# Altium schematic sheet Sedra LPN.SchDoc
size A4
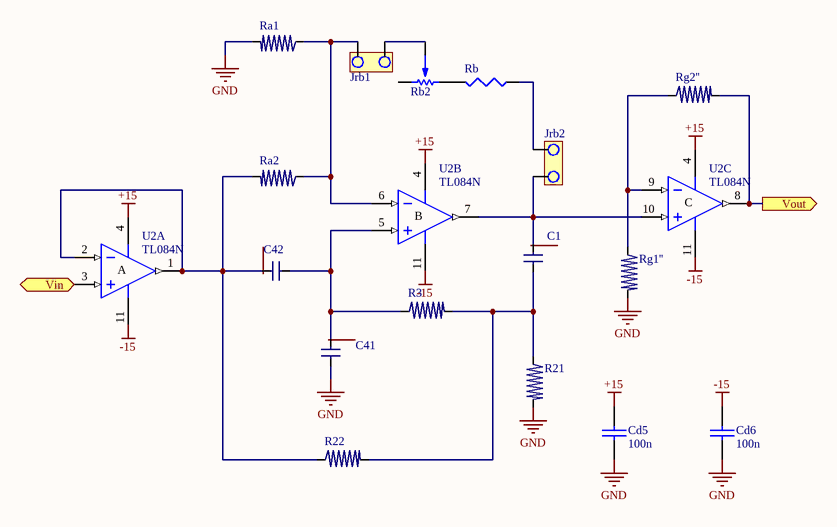
[diagram p0: Sedra LPN.SchDoc]

## Parts
C1  (no value)  [Model Name]
C41  (no value)  [PCBComponent_1]
C42  (no value)  [PCBComponent_1]
Cd5  100n  [CAP200]
Cd6  100n  [CAP200]
Jrb1  (no value)  [JUMPER2]
Jrb2  (no value)  [JUMPER2]
R3  (no value)  [PCBComponent_1]
R21  (no value)  [PCBComponent_1]
R22  (no value)  [PCBComponent_1]
Ra1  (no value)  [PCBComponent_1]
Ra2  (no value)  [PCBComponent_1]
Rb  (no value)  [RES400]
Rb2  (no value)  [PRESET V]
Rg1''  (no value)  [PCBComponent_1]
Rg2''  (no value)  [PCBComponent_1]
U2  TL084N  [N014]  (parts A,B,C of 4)

## Ports
Vin (in), Vout (out)

## Nets
+15: Cd5.1 U2.4(V+)
-15: Cd6.1 U2.11(V-)
GND: C41.1 Cd5.2 Cd6.2 R21.1 Ra1.1 Rg1''.1
Vin: U2.3(IN+) ; port Vin
Vout: Rg2''.1 U2.8(OUT) ; port Vout
NetC1_1: C1.1 R3.1 R21.2 R22.1
NetC1_2: C1.2 Jrb2.1 U2.7(OUT) U2.10(IN+)
NetC41_2: C41.2 C42.1 R3.2 U2.5(IN+)
NetC42_2: C42.2 R22.2 Ra2.1 U2.1(OUT) U2.2(IN-)
NetJrb1_1: Jrb1.1 Ra1.2 Ra2.2 U2.6(IN-)
NetJrb1_2: Jrb1.2 Rb2.2
NetJrb2_2: Jrb2.2 Rb.1
NetRb_2: Rb.2 Rb2.3
NetRg1''_2: Rg1''.2 Rg2''.2 U2.9(IN-)

Not connected (* = marked no-connect by the designer): Rb2 1

## Notes on the sheet
- (in symbol TL084N, part A) A
- (in symbol TL084N, part B) B
- (in symbol TL084N, part C) C

## Library data of the parts
C1 C41 C42 = Sheet1
Cd5 Cd6 = CAP
Jrb1 Jrb2 = JUMPER
R3 R21 R22 Ra1 Ra2 Rg1'' Rg2'' = SPres
Rb = Res3: Resistor; Published: 8-Jun-2000; LatestRevisionDate: 29-May-2009; LatestRevisionNote: IPC-7351 Footprint Added.; PackageReference: J1-0603; Publisher: Altium Limited; PackageDescription: Chip Resistor
Rb2 = PRESET
U2 = TL084N: JFET-Input Operational Amplifier; Published: 16-Jan-2001; LatestRevisionDate: 04-Mar-2005; LatestRevisionNote: Stylized 3D Model Added.; DatasheetVersion: Feb-1999; PackageVersion: Oct-1995; PackageReference: N014; Publisher: Altium Limited; PackageDescription: DIP; 14 Leads; Row Spacing 7.62 mm; Pitch 2.54 mm; ComponentLink1Description: Manufacturer Link; ComponentLink1URL: http://www.ti.com/; ComponentLink2Description: Datasheet; ComponentLink2URL: http://www-s.ti.com/sc/ds/tl084.pdf